# EAGLE design relay (EAGLE 8.4.1)
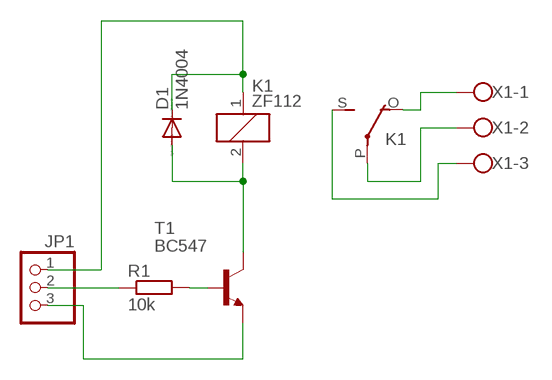
[diagram p0: schematic, sheet 1]

## Parts
D1  1N4004  [DO41-10]
JP1  PINHD-1X3  [1X03]
K1  ZF112  [ZF112]
R1  10k  R-EU_0204/7  [0204/7]
T1  BC547  [TO92]
X1  W237-103  [W237-103]

## Nets
N$1: D1.C JP1.1 K1.1
N$2: D1.A K1.2 T1.3(C)
N$3: R1.2 T1.2(B)
N$4: K1.O(2:O) X1.1
N$5: K1.S(2:S) X1.3
N$6: K1.P(2:P) X1.2
N$8: JP1.3 T1.1(E)
N$10: JP1.2 R1.1

## Library data of the parts
D1 = diode:1N4004: DIODE general purpose rectifier, 1 A
JP1 = pinhead:PINHD-1X3: PIN HEADER
K1 = relay:ZF112: RELAY 1 x switch; OC_FARNELL: unknown; OC_NEWARK: unknown
R1 = resistor:R-EU_: RESISTOR, European symbol
T1 = transistor:BC547: NPN TRANSISTOR
X1 = con-wago-500:W237-103: WAGO SCREW CLAMP; MPN: 237-103; OC_FARNELL: unknown; OC_NEWARK: 18M7116

## Board
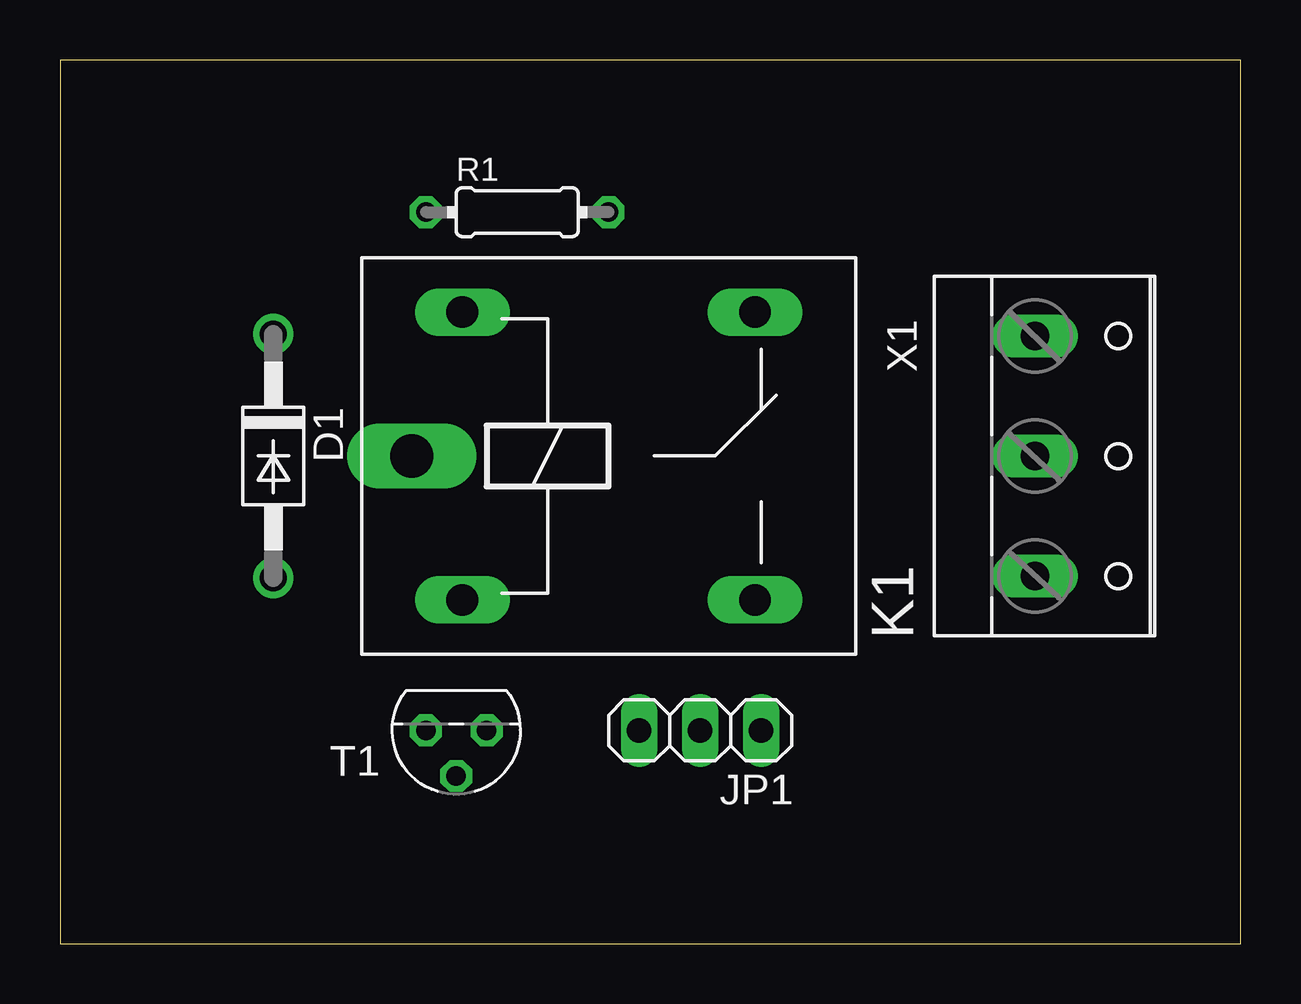
[diagram p1: board, top side]
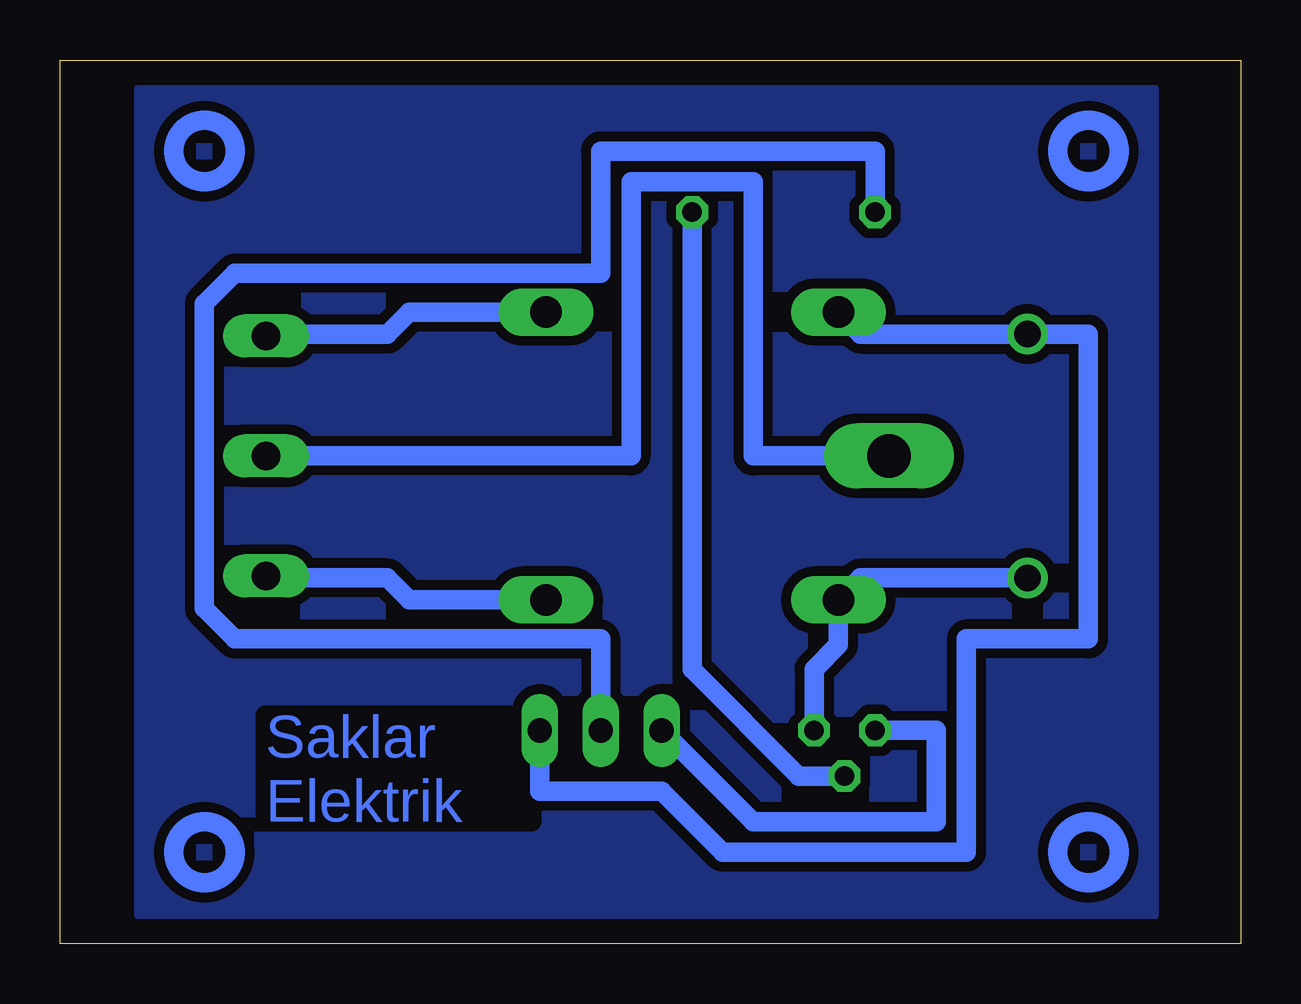
[diagram p2: board, bottom side, seen from below]

Size 49.2 x 36.82 mm. Coordinates in mm from the lower left corner, seen from the top.
Outline: 0,0 49.2,0 49.2,36.82 0,36.82 0,0
Copper layers (1*16): Top 0.035mm / dielectric 1.5mm / Bottom 0.035mm
Design rules "default": minimum track width 6mil, minimum drill 0.35mm, track to track 6mil, track to pad 6mil, pad to pad 6mil, via to via 6mil, smd to smd 6mil, copper to edge 40mil, drill to drill 6mil, minimum pad ring 10mil, minimum via ring 8mil, stop-mask expansion 4mil, vias tented up to drill 0mil, thermal gap 10mil

### Footprints (pad centres in the part's own frame; a part is rotated, then mirrored left to right if it is on the bottom)
DO41-10 = drill 1.118: A 5.08,0; C -5.08,0
1X03 = drill 1.016 long: 1 -2.54,0; 2 0,0; 3 2.54,0
ZF112 = drill 1.321 long: 1 -6.096,5.994; 2 -6.096,-5.994; O 6.096,5.994; S 6.096,-5.994 | drill 1.803 long: P -8.204,0
0204/7 = drill 0.813 octagon: 1 -3.81,0; 2 3.81,0
TO92 = drill 0.813 octagon: 1 1.27,0; 2 0,1.905; 3 -1.27,0
W237-103 = drill 1.194 long: 1 -5,-1.29; 2 0,-1.29; 3 5,-1.29

### Placement (x,y rotation side)
D1  8.89,20.32 270 top
JP1  26.67,8.89 180 top
K1  22.86,20.32 0 top
R1  19.05,30.48 0 top
T1  16.51,8.89 180 top
X1  41.91,20.32 270 top

### Tracks (layer width: path | path; a pad name or v marks a point on that pad's centre or on a via)
N$1
  Bottom 0.813: K1.1 15.85,25.4 D1.C 6.35,25.4 6.35,12.7 11.43,12.7 11.43,3.81 21.59,3.81 24.13,6.35 29.21,6.35 JP1.1
N$2
  Bottom 0.813: T1.3 17.78,11.43 16.76,12.45 K1.2 15.85,15.24 D1.A
N$3
  Bottom 0.813: T1.2 18.41,6.98 22.86,11.43 R1.2
N$4
  Bottom 0.813: K1.O 34.65,26.31 35.56,25.4 40.54,25.4 X1.1
N$5
  Bottom 0.813: K1.S 34.65,14.33 35.56,15.24 40.54,15.24 X1.3
N$6
  Bottom 0.813: K1.P 20.32,20.32 20.32,31.75 25.4,31.75 25.4,20.32 X1.2
N$7
  pour Bottom (isolate 0.406): 3.81,35.56 45.72,35.56 45.72,1.27 3.81,1.27
N$8
  Bottom 0.813: T1.1 12.7,8.89 12.7,5.08 20.32,5.08 JP1.3
N$10
  Bottom 0.813: R1.1 15.24,33.02 26.67,33.02 26.67,27.94 41.91,27.94 43.18,26.67 43.18,13.97 41.91,12.7 26.67,12.7 JP1.2
(copper drawn outside any net)
  shapes: Bottom circle x4

### Text on the board
Bottom: Saklar / Elektrik